# Altium schematic sheet NRF51822.SchDoc
size A4
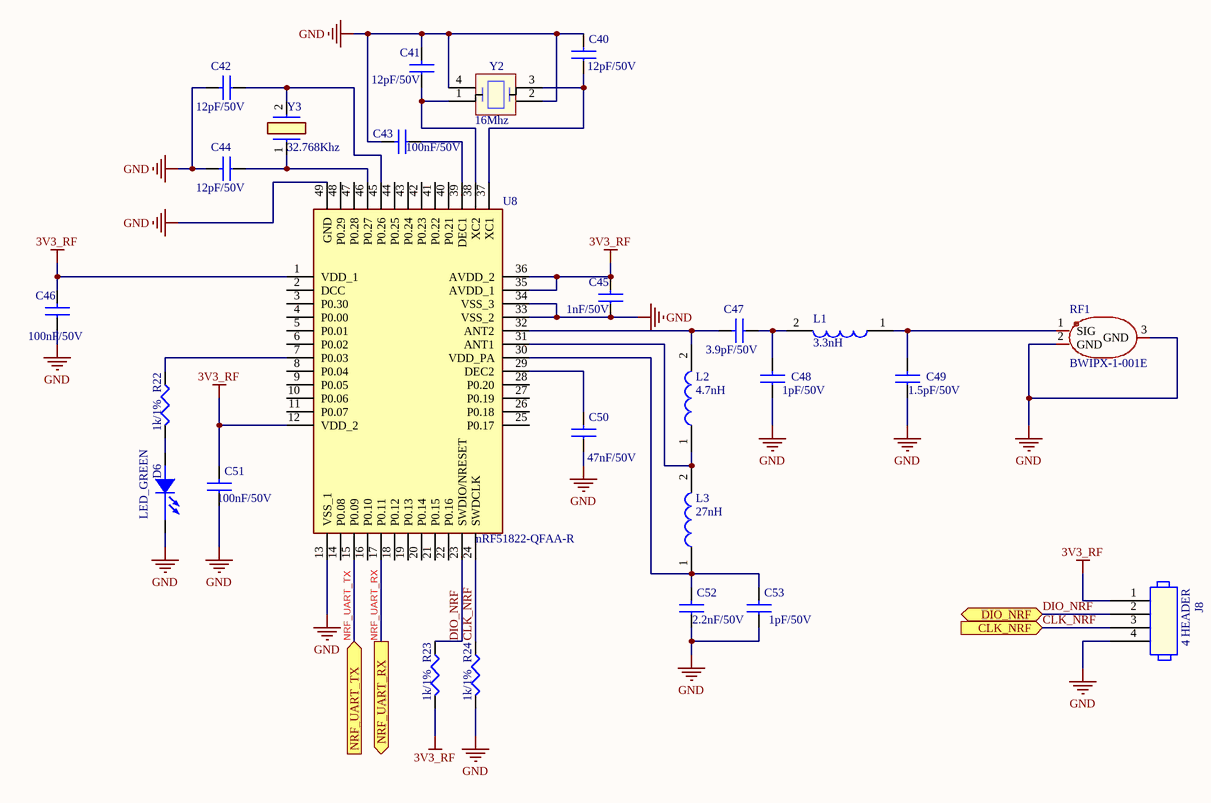
[diagram p0: NRF51822.SchDoc]

## Parts
C40  12pF/50V  [C0402]
C41  12pF/50V  [C0402]
C42  12pF/50V  [C0402]
C43  100nF/50V  [C0402]
C44  12pF/50V  [C0402]
C45  1nF/50V  [C0402]
C46  100nF/50V  [C0402]
C47  3.9pF/50V  [C0402]
C48  1pF/50V  [C0402]
C49  1.5pF/50V  [C0402]
C50  47nF/50V  [C0402]
C51  100nF/50V  [C0402]
C52  2.2nF/50V  [C0402]
C53  1pF/50V  [C0402]
D6  LED_GREEN  [LED0603]
J8  4 HEADER  [ISP-4P-2_54]
L1  3.3nH  [LQG15WH0N7B02D]
L2  4.7nH  [LQG15WH0N7B02D]
L3  27nH  [LQG15WH0N7B02D]
R22  1k/1%  [R0402]
R23  1k/1%  [R0402]
R24  1k/1%  [R0402]
RF1  BWIPX-1-001E  [IPEX-SMD_BWIPX-1-001E]
U8  nRF51822-QFAA-R  [QFN40P600X600X95-49N-D]
Y2  16Mhz  [Q22FA12800400]
Y3  32.768Khz  [ABS0532768KHZ9T]

## Ports
CLK_NRF (in, see VESC_75100[2C]), DIO_NRF (bidir, see VESC_75100[2C]), NRF_UART_RX (out, see VESC_75100[2C]), NRF_UART_TX (in, see VESC_75100[2C])

## Nets
3V3_RF: C45.2 C46.2 C51.2 J8.1 R23.1 U8.1(VDD_1) U8.12(VDD_2) U8.35(AVDD_1) U8.36(AVDD_2)
GND: C40.2 C41.2 C42.2 C43.2 C44.2 C45.1 C46.1 C48.1 C49.1 C50.1 C51.1 C52.1 C53.1 D6.1(CATHODE) J8.4 R24.1 RF1.2(GND) RF1.3(GND) U8.13(VSS_1) U8.33(VSS_2) U8.34(VSS_3) U8.49(GND) Y2.2(GND_1) Y2.4(GND_2)
CLK_NRF: J8.3 R24.2 U8.24(SWDCLK) ; port CLK_NRF
DIO_NRF: J8.2 R23.2 U8.23(SWDIO/NRESET) ; port DIO_NRF
NRF_UART_RX: U8.17(P0.11) ; port NRF_UART_RX
NRF_UART_TX: U8.15(P0.09) ; port NRF_UART_TX
NetC40_1: C40.1 U8.37(XC1) Y2.3(CRYSTAL_2)
NetC41_1: C41.1 U8.38(XC2) Y2.1(CRYSTAL_1)
NetC42_1: C42.1 U8.45(P0.26) Y3.2
NetC43_1: C43.1 U8.39(DEC1)
NetC44_1: C44.1 U8.46(P0.27) Y3.1
NetC47_1: C47.1 C48.2 L1.2
NetC47_2: C47.2 L2.2 U8.32(ANT2)
NetC49_2: C49.2 L1.1 RF1.1(SIG)
NetC50_2: C50.2 U8.29(DEC2)
NetC52_2: C52.2 C53.2 L3.1 U8.30(VDD_PA)
NetD6_2: D6.2(ANODE) R22.1
NetL2_1: L2.1 L3.2 U8.31(ANT1)
NetR22_2: R22.2 U8.7(P0.03)

Not connected (* = marked no-connect by the designer): U8 2(DCC) 3(P0.30) 4(P0.00) 5(P0.01) 6(P0.02) 8(P0.04) 9(P0.05) 10(P0.06) 11(P0.07) 14(P0.08) 16(P0.10) 18(P0.12) 19(P0.13) 20(P0.14) 21(P0.15) 22(P0.16) 25(P0.17) 26(P0.18) 27(P0.19) 28(P0.20) 40(P0.21) 41(P0.22) 42(P0.23) 43(P0.24) 44(P0.25) 47(P0.28) 48(P0.29)

## Library data of the parts
C40-C53 = CAP NP: PCB Footprint: C0402
D6 = LED: PCB Footprint: LED0603
L1-L3 = LQG15HS4N7C02D: Inductor; Manufacturer_Name: Murata Electronics; Datasheet Link: https://search.murata.co.jp/Ceramy/image/img/P02/JELF243B-0010.pdf; Height: 0.6mm; Manufacturer_Part_Number: LQG15HS4N7C02D; Mouser Part Number: 81-LQG15HS4N7C02D; Mouser Price/Stock: https://www.mouser.co.uk/ProductDetail/Murata-Electronics/LQG15HS4N7C02D?qs=60uY6ySkanQsgm4t8ngjFA%3D%3D; Arrow Part Number: LQG15HS4N7C02D; Arrow Price/Stock: https://www.arrow.com/en/products/lqg15hs4n7c02d/murata-manufacturing
R22-R24 = RESISTOR: PCB Footprint: R0402
RF1 = BWIPX-1-001E: Manufacturer: BAT WIRELESS(蝙蝠无线); Add into BOM: yes; Connector Type: 板端; Interface Type: 内针; Number of Ports: 1; Frequency-Max: 6GHz; RF Series: IPEX; Impedance: 50Ω; Symbol: BWIPX-1-001E; Device: BWIPX-1-001E; LCSC Part Name: IPEX 内针; Supplier Part: C496552; Manufacturer Part: BWIPX-1-001E; Supplier Footprint: SMD; JLCPCB Part Class: 扩展库; Datasheet: https://atta.szlcsc.com/upload/public/pdf/source/20201223/C496552_05E5A9956EAE1A8819C5051D085B1DED.pdf; Supplier: LCSC; Convert to PCB: yes; Interface Diameter: -; Interface Length/Height: -; Style: -; Operating Temperature Range: -
U8 = nRF51822-QFAA-R: Integrated Circuit; Manufacturer_Name: Nordic Semiconductor; Datasheet Link: https://datasheet.datasheetarchive.com/originals/distributors/Datasheets-DGA5/435665.pdf; Height: 0.95mm; Manufacturer_Part_Number: nRF51822-QFAA-R; Mouser Part Number: 949-NRF51822-QFAA-R; Mouser Price/Stock: https://www.mouser.co.uk/ProductDetail/Nordic-Semiconductor/nRF51822-QFAA-R?qs=7xCC5jQa1OJP%2FZdtChopZw%3D%3D; Arrow Part Number: NRF51822-QFAA-R; Arrow Price/Stock: https://www.arrow.com/en/products/nrf51822-qfaa-r/nordic-semiconductor?utm_currency=USD&region=nac
Y2 = Q22FA12800400: Crystal or Oscillator; Manufacturer_Name: Seiko Epson Corporation; Datasheet Link: https://datasheet.lcsc.com/szlcsc/Seiko-Epson-Q22FA12800400_C255875.pdf; Height: 0.5mm; Manufacturer_Part_Number: Q22FA12800400
Y3 = ABS05-32.768KHZ-9-T: Crystal or Oscillator; Manufacturer_Name: ABRACON; Datasheet Link: https://abracon.com/Resonators/ABS05.pdf; Height: 0.5mm; Manufacturer_Part_Number: ABS05-32.768KHZ-9-T; Mouser Part Number: 815-ABS05-32.768K9T; Mouser Price/Stock: https://www.mouser.co.uk/ProductDetail/ABRACON/ABS05-32.768KHZ-9-T?qs=Pyu0ZBy%2FIJbsNYnIET1z3A%3D%3D; Arrow Part Number: ABS05-32.768KHZ-9-T; Arrow Price/Stock: https://www.arrow.com/en/products/abs05-32.768khz-9-t/abracon?region=nac
J8 = 4 HEADER: PCB Footprint: ISP-4P-2_54